# EAGLE schematic oldcars (EAGLE 8.4.1)

## Sheet 1 of 2
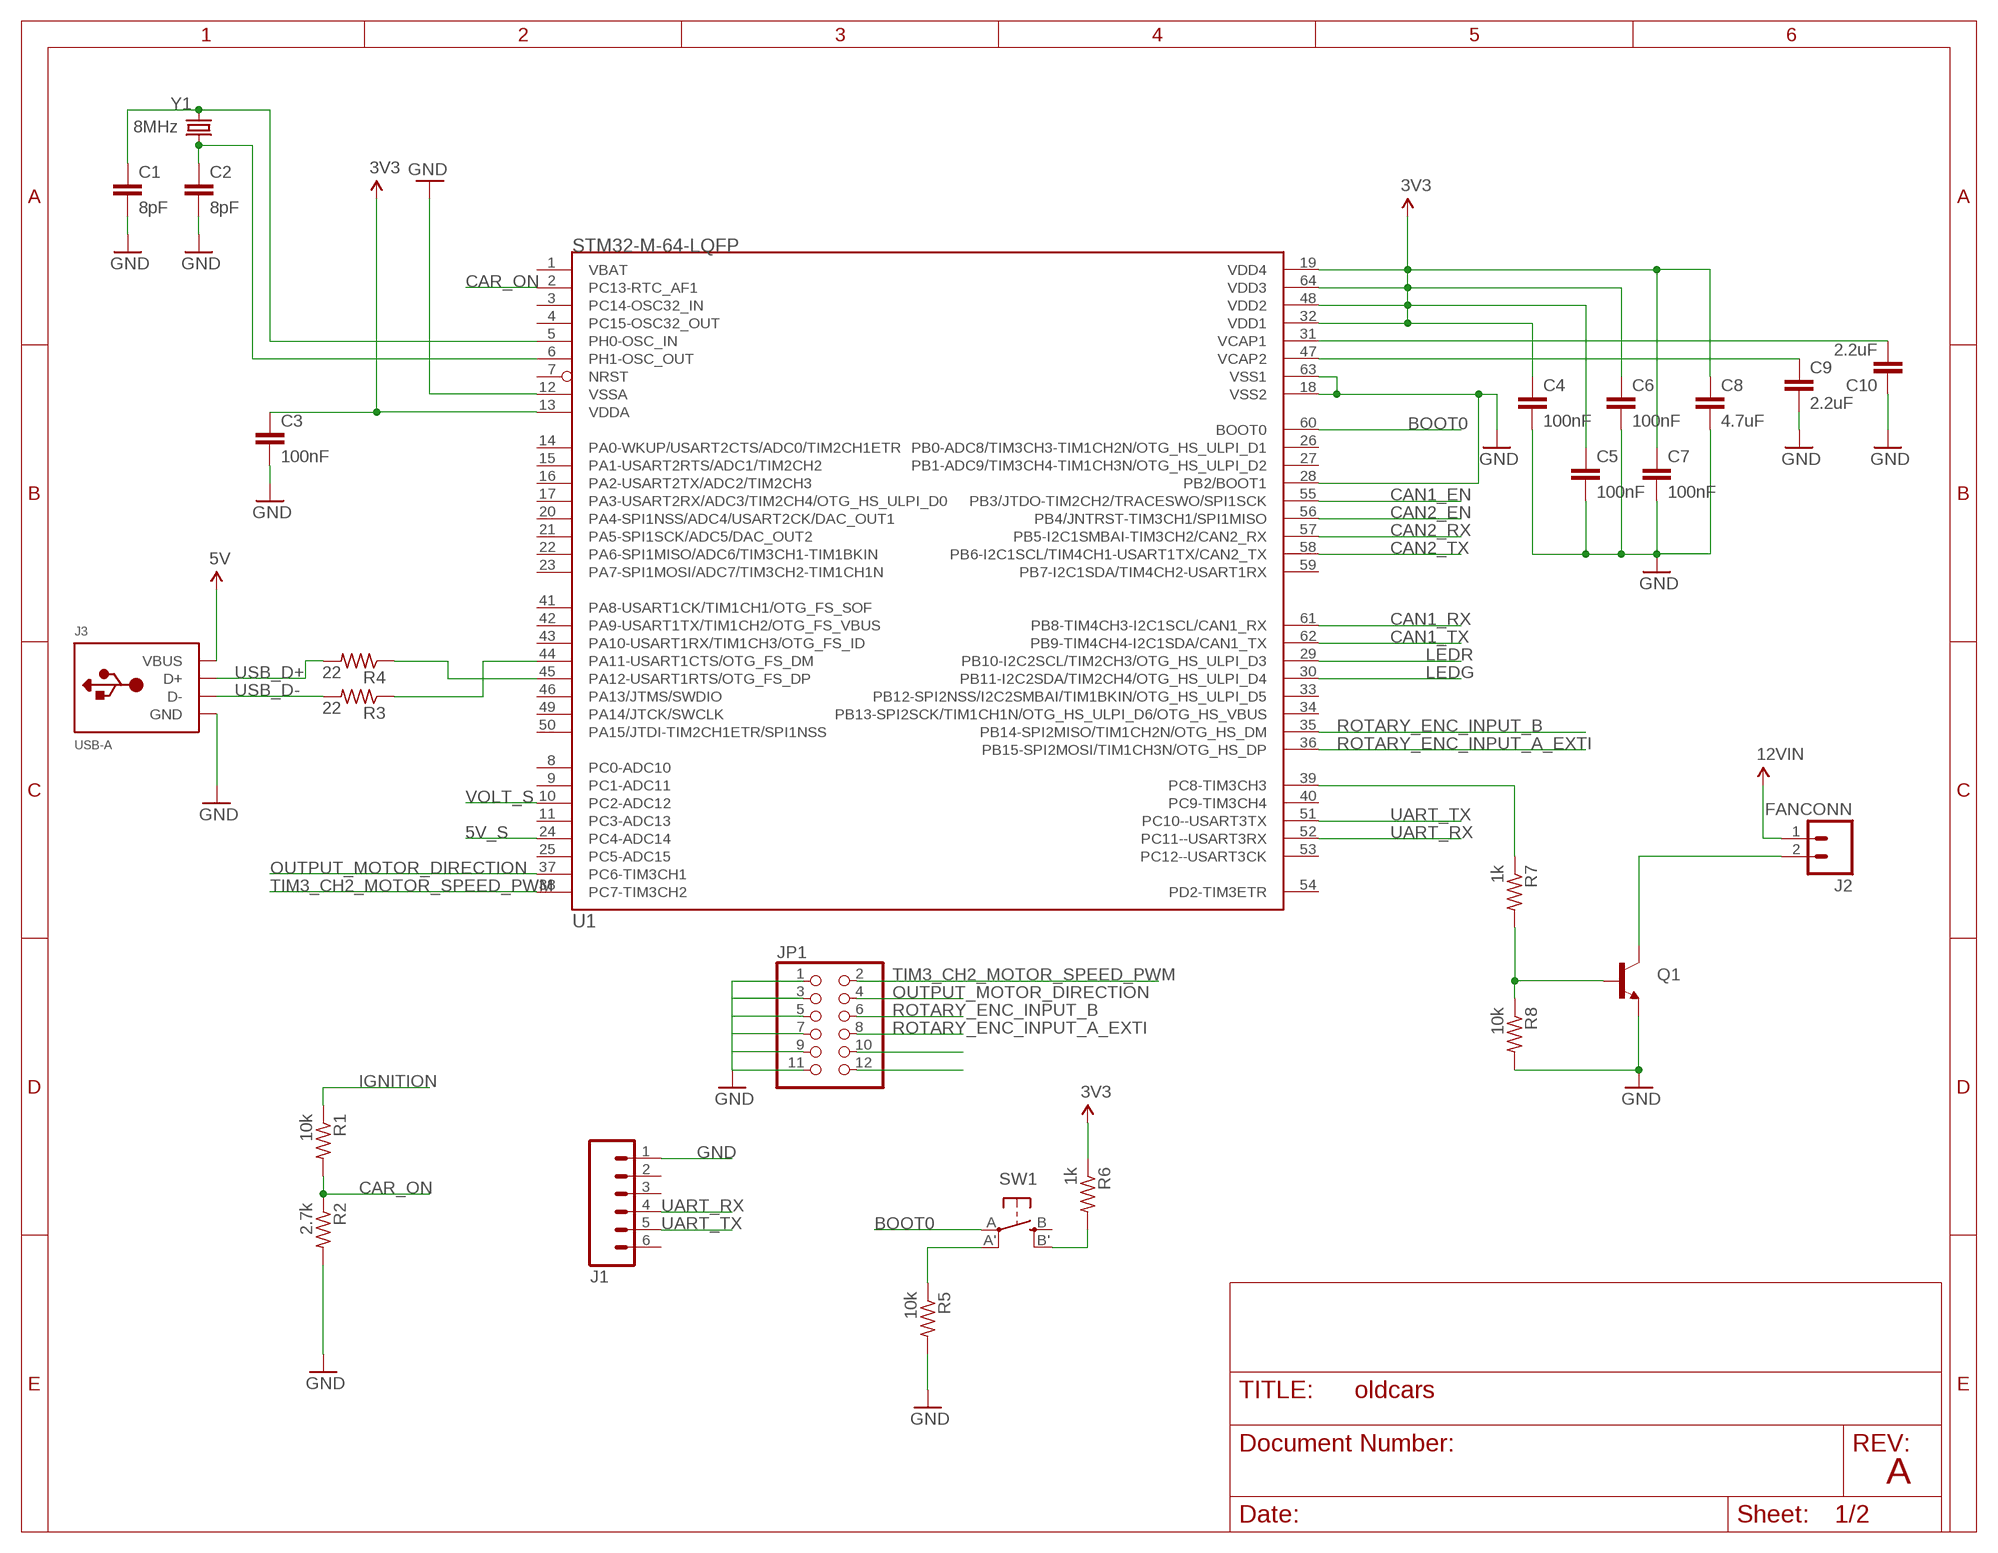
[diagram p0: schematic, sheet 1]

### Parts
C1  8pF  1.0UF-16V-10%(0603)  [0603-CAP]
C2  8pF  1.0UF-16V-10%(0603)  [0603-CAP]
C3  100nF  1.0UF-16V-10%(0603)  [0603-CAP]
C4  100nF  1.0UF-16V-10%(0603)  [0603-CAP]
C5  100nF  1.0UF-16V-10%(0603)  [0603-CAP]
C6  100nF  0.1UF-25V-5%(0603)  [0603-CAP]
C7  100nF  1.0UF-16V-10%(0603)  [0603-CAP]
C8  4.7uF  1.0UF-16V-10%(0603)  [0603-CAP]
C9  2.2uF  1.0UF-16V-10%(0603)  [0603-CAP]
C10  2.2uF  1.0UF-16V-10%(0603)  [0603-CAP]
J1  M06NO_SILK_YES_STOP  [1X06_NO_SILK_YES_STOP]
J2  FANCONN  [1.25CONN]
J3  USB-A  [MOLEX_480371000]
JP1  PINHD-2X6  [2X06]
Q1  MMBT2222A  TRANSISTOR_NPNMMBT2222A  [SOT23-3]
R1  10k  R-US_R0603  [R0603]
R2  2.7k  R-US_R0603  [R0603]
R3  22  R-US_R0603  [R0603]
R4  22  R-US_R0603  [R0603]
R5  10k  R-US_R0603  [R0603]
R6  1k  R-US_R0603  [R0603]
R7  1k  R-US_R0603  [R0603]
R8  10k  R-US_R0603  [R0603]
SW1  SPST_TACT-EVQQ2  [EVQ-Q2]
U1  STM32-M-64-LQFP  [LQFP64]
Y1  8MHz  CRYSTALTXC-7A  [CRYSTAL-TXC-7A]

### Nets
3V3: C3.1 C4.1 C5.1 C6.1 C7.1 C8.1 R6.1 U1.13(VDDA) U1.19(VDD4) U1.32(VDD1) U1.48(VDD2) U1.64(VDD3) ; also sheet 2
5V: J3.1(VBUS) ; also sheet 2
5V_S: U1.24(PC4-ADC14) ; also sheet 2
12VIN: J2.1 ; also sheet 2
BOOT0: SW1.A(P) U1.60(BOOT0)
CAN1_EN: U1.55(PB3/JTDO-TIM2CH2/TRACESWO/SPI1SCK) ; also sheet 2
CAN1_RX: U1.61(PB8-TIM4CH3-I2C1SCL/CAN1_RX) ; also sheet 2
CAN1_TX: U1.62(PB9-TIM4CH4-I2C1SDA/CAN1_TX) ; also sheet 2
CAN2_EN: U1.56(PB4/JNTRST-TIM3CH1/SPI1MISO) ; also sheet 2
CAN2_RX: U1.57(PB5-I2C1SMBAI-TIM3CH2/CAN2_RX) ; also sheet 2
CAN2_TX: U1.58(PB6-I2C1SCL/TIM4CH1-USART1TX/CAN2_TX) ; also sheet 2
CAR_ON: R1.2 R2.1 U1.2(PC13-RTC_AF1)
FAN_PWM: R7.1 U1.39(PC8-TIM3CH3)
GND: C1.2 C2.2 C3.2 C4.2 C5.2 C6.2 C7.2 C8.2 C9.2 C10.1 J1.1 J3.4(GND) JP1.1 JP1.3 JP1.5 JP1.7 JP1.9 Q1.2(E) R2.2 R5.2 R8.2 U1.12(VSSA) U1.18(VSS2) U1.28(PB2/BOOT1) U1.63(VSS1) ; also sheet 2
IGNITION: R1.1 ; also sheet 2
LEDG: U1.30(PB11-I2C2SDA/TIM2CH4/OTG_HS_ULPI_D4) ; also sheet 2
LEDR: U1.29(PB10-I2C2SCL/TIM2CH3/OTG_HS_ULPI_D3) ; also sheet 2
N$1: C1.1 U1.5(PH0-OSC_IN) Y1.P$1
N$3: C2.1 U1.6(PH1-OSC_OUT) Y1.P$2
N$5: R4.1 U1.45(PA12-USART1RTS/OTG_FS_DP)
N$6: J2.2 Q1.3(C)
N$7: Q1.1(B) R7.2 R8.1
N$8: R5.1 SW1.A'(P1)
N$14: R6.2 SW1.B'(S1)
N$35: R3.1 U1.44(PA11-USART1CTS/OTG_FS_DM)
OUTPUT_MOTOR_DIRECTION: U1.37(PC6-TIM3CH1)
ROTARY_ENC_INPUT_A_EXTI: U1.36(PB15-SPI2MOSI/TIM1CH3N/OTG_HS_DP)
ROTARY_ENC_INPUT_B: U1.35(PB14-SPI2MISO/TIM1CH2N/OTG_HS_DM)
TIM3_CH2_MOTOR_SPEED_PWM: U1.38(PC7-TIM3CH2)
UART_RX: J1.4 U1.52(PC11--USART3RX)
UART_TX: J1.5 U1.51(PC10--USART3TX)
USB_D+: J3.3(D+) R4.2
USB_D-: J3.2(D-) R3.2
VCAP1: C10.2 U1.31(VCAP1)
VCAP2: C9.1 U1.47(VCAP2)
VOLT_S: U1.10(PC2-ADC12) ; also sheet 2
Unconnected: J1.2 J1.3 J1.6 JP1.2 JP1.4 JP1.6 JP1.8 JP1.10 JP1.11 JP1.12 SW1.B(S) U1.1(VBAT) U1.3(PC14-OSC32_IN) U1.4(PC15-OSC32_OUT) U1.7(NRST) U1.8(PC0-ADC10) U1.9(PC1-ADC11) U1.11(PC3-ADC13) U1.14(PA0-WKUP/USART2CTS/ADC0/TIM2CH1ETR) U1.15(PA1-USART2RTS/ADC1/TIM2CH2) U1.16(PA2-USART2TX/ADC2/TIM2CH3) U1.17(PA3-USART2RX/ADC3/TIM2CH4/OTG_HS_ULPI_D0) U1.20(PA4-SPI1NSS/ADC4/USART2CK/DAC_OUT1) U1.21(PA5-SPI1SCK/ADC5/DAC_OUT2) U1.22(PA6-SPI1MISO/ADC6/TIM3CH1-TIM1BKIN) U1.23(PA7-SPI1MOSI/ADC7/TIM3CH2-TIM1CH1N) U1.25(PC5-ADC15) U1.26(PB0-ADC8/TIM3CH3-TIM1CH2N/OTG_HS_ULPI_D1) U1.27(PB1-ADC9/TIM3CH4-TIM1CH3N/OTG_HS_ULPI_D2) U1.33(PB12-SPI2NSS/I2C2SMBAI/TIM1BKIN/OTG_HS_ULPI_D5) U1.34(PB13-SPI2SCK/TIM1CH1N/OTG_HS_ULPI_D6/OTG_HS_VBUS) U1.40(PC9-TIM3CH4) U1.41(PA8-USART1CK/TIM1CH1/OTG_FS_SOF) U1.42(PA9-USART1TX/TIM1CH2/OTG_FS_VBUS) U1.43(PA10-USART1RX/TIM1CH3/OTG_FS_ID) U1.46(PA13/JTMS/SWDIO) U1.49(PA14/JTCK/SWCLK) U1.50(PA15/JTDI-TIM2CH1ETR/SPI1NSS) U1.53(PC12--USART3CK) U1.54(PD2-TIM3ETR) U1.59(PB7-I2C1SDA/TIM4CH2-USART1RX)

### Notes on the sheet
- A

## Sheet 2 of 2
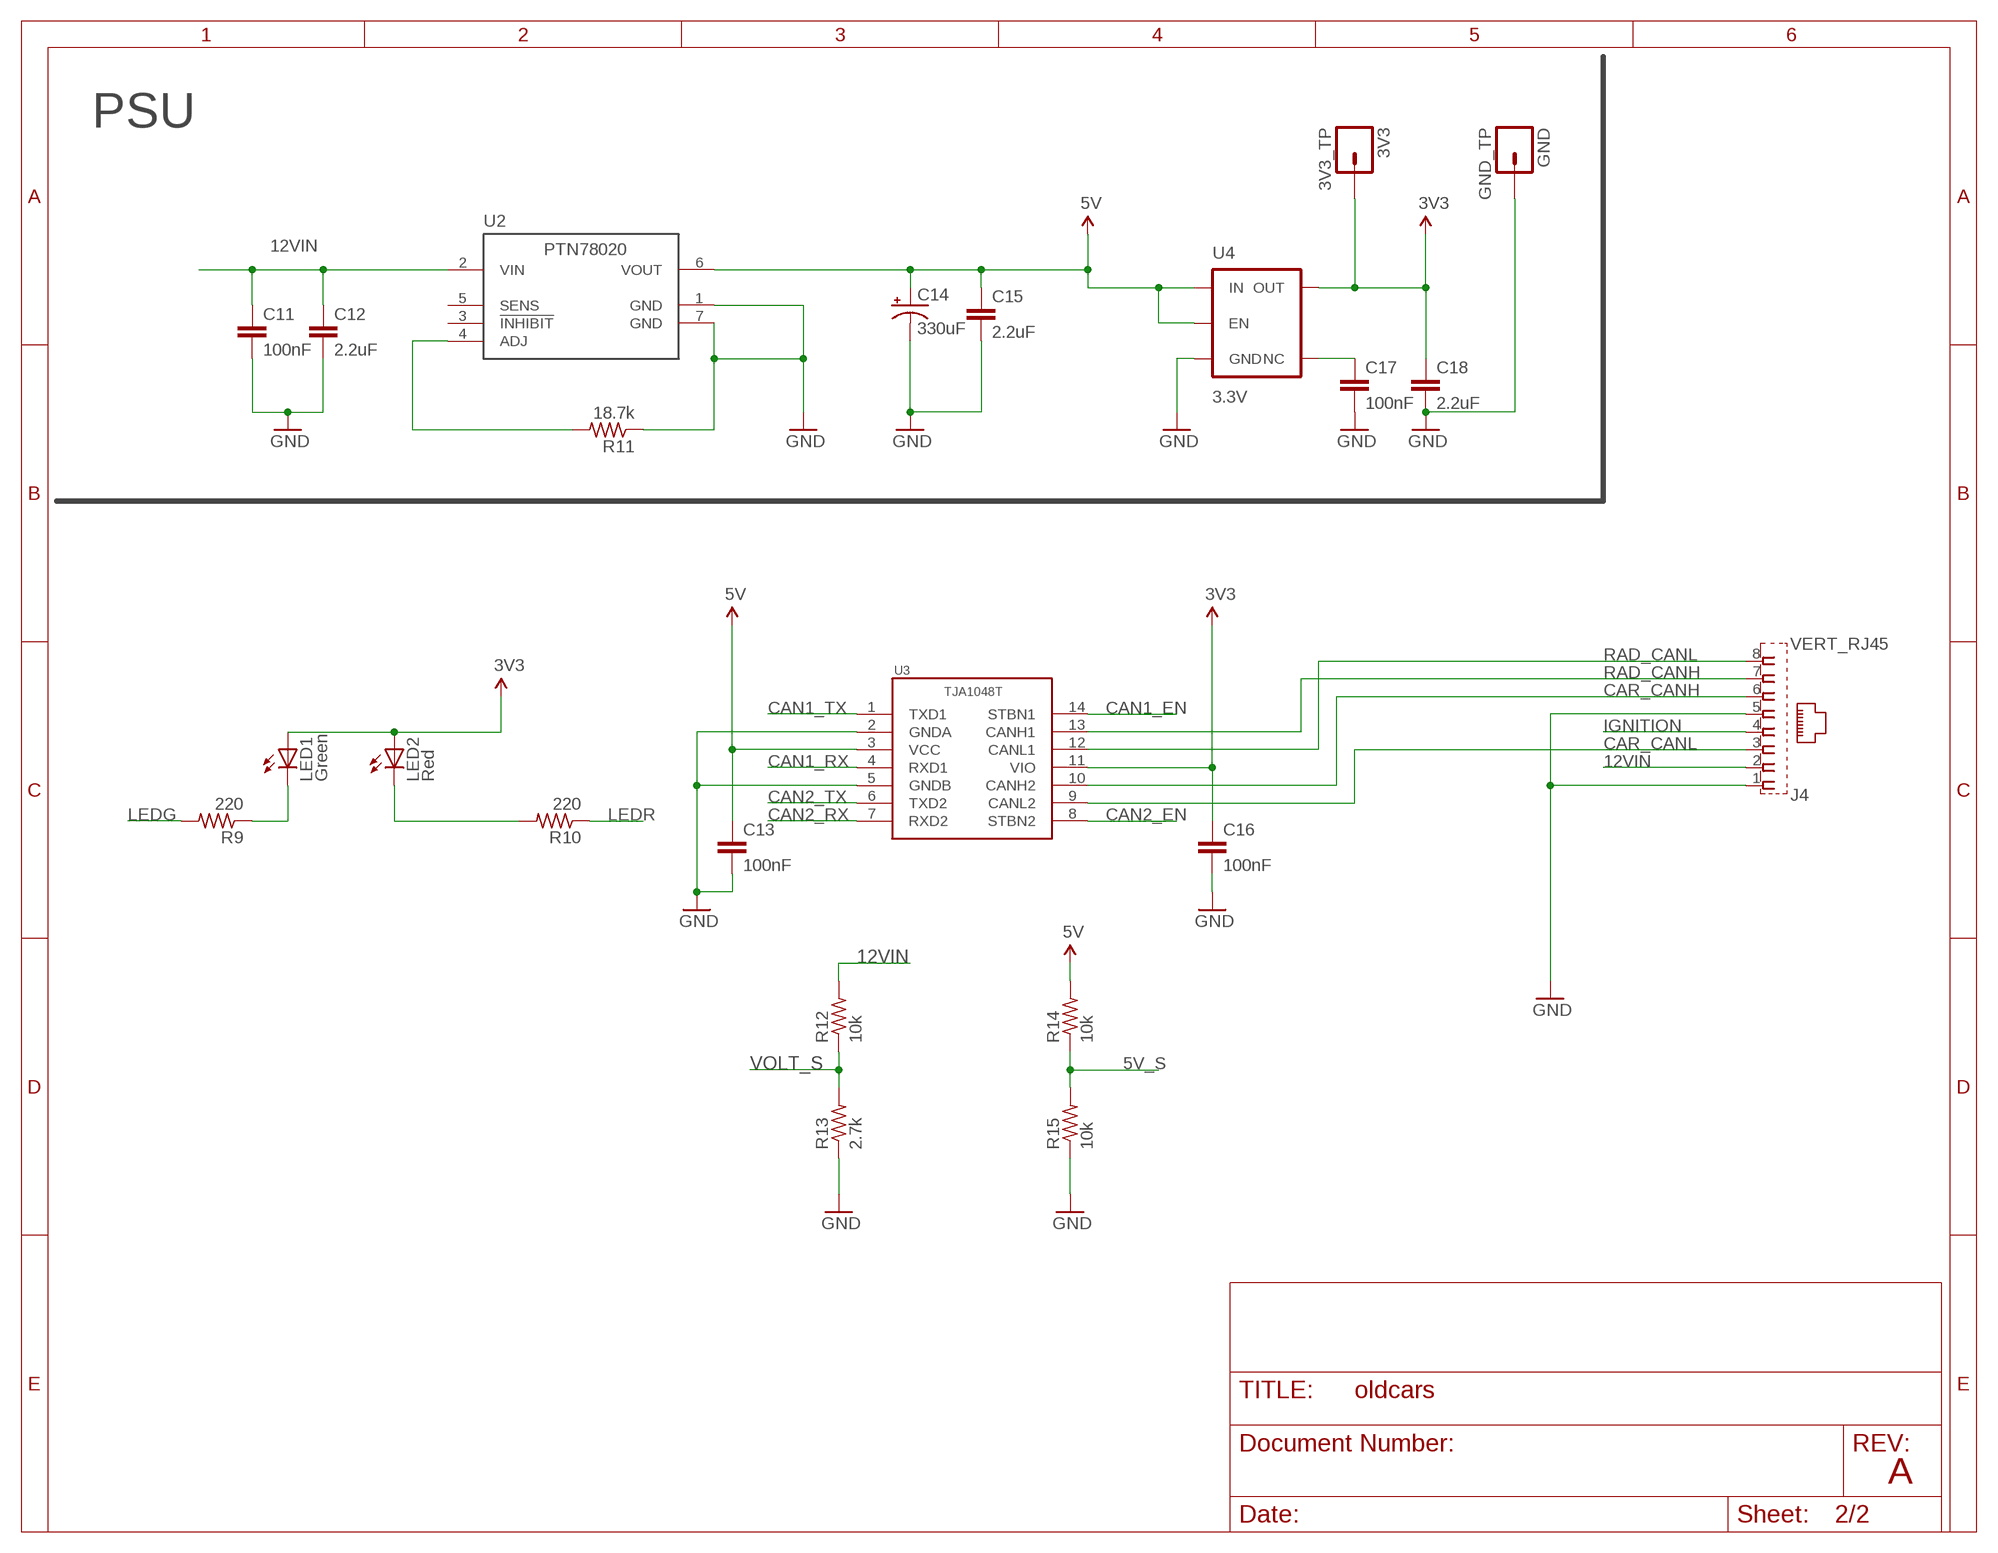
[diagram p1: schematic, sheet 2]

### Parts
3V3  3V3_TP  M01PTH_NO_SILK_YES_STOP  [1X01_NO_SILK]
C11  100nF  0.22UF-25V-10%(0603)  [0603-CAP]
C12  2.2uF  2.2UF-25V-+80/-20(0805)  [0805-CAP]
C13  100nF  CAP0603-CAP  [0603-CAP]
C14  330uF  C-POL  [E3,5-8]
C15  2.2uF  2.2UF-25V-+80/-20(0805)  [0805-CAP]
C16  100nF  CAP0603-CAP  [0603-CAP]
C17  100nF  CAP0603-CAP  [0603-CAP]
C18  2.2uF  CAP0603-CAP  [0603-CAP]
GND  GND_TP  M01PTH_NO_SILK_YES_STOP  [1X01_NO_SILK]
J4  VERT_RJ45  [GLX-S-88M]
LED1  Green  LEDCHIPLED_0805  [CHIPLED_0805]
LED2  Red  LEDCHIPLED_0805  [CHIPLED_0805]
R9  220  R-US_R0603  [R0603]
R10  220  R-US_R0603  [R0603]
R11  18.7k  R-US_R0603  [R0603]
R12  10k  R-US_R0603  [R0603]
R13  2.7k  R-US_R0603  [R0603]
R14  10k  R-US_R0603  [R0603]
R15  10k  R-US_R0603  [R0603]
U2  PTN78020W  [PTN78020W]
U3  TJA1048  [SO14]
U4  3.3V  V_REG_AP2112K-3.3V  [SOT23-5]

### Nets
3V3: 3V3.1 C16.1 C18.1 LED1.A LED2.A U3.11(VIO) U4.5(OUT) ; also sheet 1
5V: C13.1 C14.+ C15.1 R14.2 U2.6(VOUT) U3.3(VCC) U4.1(IN) U4.3(EN) ; also sheet 1
5V_S: R14.1 R15.2 ; also sheet 1
12VIN: C11.1 C12.1 J4.2 R12.2 U2.2(VIN) ; also sheet 1
CAN1_EN: U3.14(STBN1) ; also sheet 1
CAN1_RX: U3.4(RXD1) ; also sheet 1
CAN1_TX: U3.1(TXD1) ; also sheet 1
CAN2_EN: U3.8(STBN2) ; also sheet 1
CAN2_RX: U3.7(RXD2) ; also sheet 1
CAN2_TX: U3.6(TXD2) ; also sheet 1
CAR_CANH: J4.6 U3.10(CANH2)
CAR_CANL: J4.3 U3.9(CANL2)
GND: C11.2 C12.2 C13.2 C14.- C15.2 C16.2 C17.2 C18.2 GND.1 J4.1 J4.5 R11.1 R13.1 R15.1 U2.1(GND) U2.7(GND) U3.2(GNDA) U3.5(GNDB) U4.2(GND) ; also sheet 1
IGNITION: J4.4 ; also sheet 1
LEDG: R9.2 ; also sheet 1
LEDR: R10.1 ; also sheet 1
N$12: LED2.C R10.2
N$13: LED1.C R9.1
N$24: R11.2 U2.4(ADJ)
N$29: C17.1 U4.4(NC)
RAD_CANH: J4.7 U3.13(CANH1)
RAD_CANL: J4.8 U3.12(CANL1)
VOLT_S: R12.1 R13.2 ; also sheet 1
Unconnected: U2.3(!INHIBIT) U2.5(SENS)

### Notes on the sheet
- PSU
- A

## Library data of the parts
3V3 GND = SparkFun-Connectors:M01: Header 1 Standard 1-pin 0.1" header. Use with straight break away headers (SKU : PRT-00116), right angle break away headers (PRT-00553), swiss pins (PRT-00743), machine pins (PRT-00117), and female headers (PRT-00115). SMTSO-256-ET is a "flush mount" nut for a 4-40 screw. The older package used to be too tight, and did not allow it to sit properly thru the drill hit. The latest (0.165DIA) fits nice and snug.
C1-C5 C7-C10 = SparkFun-Capacitors:1.0UF-16V-10%(0603): CAP-00868; PROD_ID: CAP-00868; VALUE: 1.0uF
C6 = SparkFun-Capacitors:0.1UF-25V-5%(0603): CAP-08604; PROD_ID: CAP-08604; VALUE: 0.1uF
C11 = SparkFun-Capacitors:0.22UF-25V-10%(0603): CAP-07822; PROD_ID: CAP-07822; VALUE: 0.22uF
C12 C15 = SparkFun-Capacitors:2.2UF-25V-+80/-20(0805): CAP-11624; PROD_ID: CAP-11624
C13 C16-C18 = SparkFun-Capacitors:CAP: Capacitor Standard 0603 ceramic capacitor, and 0.1" leaded capacitor.
C14 = comma.ai:C-POL
J1 = SparkFun-Connectors:M06: Header 6 Standard 6-pin 0.1" header. Use with straight break away headers (SKU : PRT-00116), right angle break away headers (PRT-00553), swiss pins (PRT-00743), machine pins (PRT-00117), and female headers (PRT-00115). Molex polarized connector foot print use with SKU : PRT-08094 with associated crimp pins and housings. NOTES ON THE VARIANTS LOCK and LOCK_LONGPADS... This footprint was designed to help hold the alignment of a through-hole component (i.e. 6-pin header) while soldering it into place. You may notice that each hole has been shifted either up or down by 0.005 of an inch from it's more standard position (which is a perfectly straight line). This slight alteration caused the pins (the squares in the middle) to touch the edges of the holes. Because they are alternating, it causes a "brace" to hold the component in place. 0.005 has proven to be the perfect amount of "off-center" position when using our standard breakaway headers. Although looks a little odd when you look at the bare footprint, once you have a header in there, the alteration is very hard to notice. Also,if you push a header all the way into place, it is covered up entirely on the bottom side. This idea of altering the position of holes to aid alignment will be further integrated into the Sparkfun Library for other footprints. It can help hold any component with 3 or more connection pins.
J2 = comma.ai:FANCONN
J3 = adafruit:USB-A: USB type A 'plug' Used for things that can directly connect to a USB port, say USB key
J4 = comma.ai:VERT_RJ45: Mod. Jack, Right Angle, 8 posiotion, 8 contatcs RJ45 Source: GLX-S-88M.pdf; OC_FARNELL: unknown; OC_NEWARK: unknown
JP1 = pinhead:PINHD-2X6: PIN HEADER
LED1 LED2 = adafruit:LED: LED OSRAM: - CHIPLED LG R971, LG N971, LY N971, LG Q971, LY Q971, LO R971, LY R971 LH N974, LH R974 LS Q976, LO Q976, LY Q976 LO Q996 - Hyper CHIPLED LW Q18S LB Q993, LB Q99A, LB R99A - SideLED LS A670, LO A670, LY A670, LG A670, LP A670 LB A673, LV A673, LT A673, LW A673 LH A674 LY A675 LS A676, LA A676, LO A676, LY A676, LW A676 LS A679, LY A679, LG A679 - Hyper Micro SIDELED® LS Y876, LA Y876, LO Y876, LY Y876 LT Y87S - SmartLED LW L88C, LW L88S LB L89C, LB L89S, LG L890 LS L89K, LO L89K, LY L89K LS L896, LA L896, LO L896, LY L896 - TOPLED LS T670, LO T670, LY T670, LG T670, LP T670 LSG T670, LSP T670, LSY T670, LOP T670, LYG T670 LG T671, LOG T671, LSG T671 LB T673, LV T673, LT T673, LW T673 LH T674 LS T676, LA T676, LO T676, LY T676, LB T676, LH T676, LSB T676, LW T676 LB T67C, LV T67C, LT T67C, LS T67K, LO T67K, LY T67K, LW E67C LS E67B, LA E67B, LO E67B, LY E67B, LB E67C, LV E67C, LT E67C LW T67C LS T679, LY T679, LG T679 LS T770, LO T770, LY T770, LG T770, LP T770 LB T773, LV T773, LT T773, LW T773 LH T774 LS E675, LA E675, LY E675, LS T675 LS T776, LA T776, LO T776, LY T776, LB T776 LHGB T686 LT T68C, LB T68C - Hyper Mini TOPLED® LB M676 - Mini TOPLED Santana® LG M470 LS M47K, LO M47K, LY M47K Source: http://www.osram.convergy.de/
Q1 = SparkFun-DiscreteSemi:TRANSISTOR_NPN: Generic NPN BJT MMBT2222A - TRANS-08049 (SOT-23, 1A 40V) MPSA42 - TRANS-09116 (SOT-23, 500mA 300V) MMBT5088LT1G - TRANS-11160 (SOT-23, 50 mA 30V) BC547 - COM-08928 <http://www.sparkfun.com/products/8928> (TO-92 45V 100mA) (1.Collector 2.Base 3.Emitter) 2N3904 - COM-00521 <http://www.sparkfun.com/products/521> (TO-92 40V 200mA) (1.Emitter 2.Base 3.Collector) P2N2222A - COM-12852 <http://www.sparkfun.com/products/12852> (TO-92 40V 600mA) (1.Collector 2.Base 3.Emitter); PROD_ID: TRANS-08049
R1-R15 = adafruit:R-US_: RESISTOR, American symbol
SW1 = adafruit:SPST_TACT: SMT 6mm switch, EVQQ2 series http://www.ladyada.net/library/eagle
U1 = comma.ai:STM32-M-64-LQFP: STM32F103 Medium Density 64pin LQFP
U2 = comma.ai:PTN78020W
U3 = comma.ai:TJA1048
U4 = SparkFun-PowerIC:V_REG_AP2112: AP2112 - 600mA CMOS LDO Regulator w/ Enable The AP2112 is CMOS process low dropout linear regulator with enable function, the regulator delivers a guaranteed 600mA (min.) continuous load current. Features Output Voltage Accuracy: ±1.5% Output Current: 600mA (Min.) Foldback Short Current Protection: 50mA Enable Function to Turn ON/OFF VOUT Low Dropout Voltage (3.3V): 250mV (Typ.) @IOUT=600mA Excellent Load Regulation: 0.2%/A (Typ.) Excellent Line Regulation: 0.02%/V (Typ.) Low Quiescent Current: 55μA (Typ.) Low Standby Current: 0.01μA (Typ.) Low Output Noise: 50μVRMS PSRR: 100Hz -65dB, 1kHz -65dB OTSD Protection Stable with 1.0μF Flexible Cap: Ceramic, Tantalum and Aluminum Electrolytic Operation Temperature Range: -40°C to 85°C ESD: MM 400V, HBM 4000V; PROD_ID: VREG-12457
Y1 = SparkFun-FreqCtrl:CRYSTAL: Various standard crystals. Proven footprints.